# Altium schematic sheet Connectors.SchDoc: Main
size OrCAD A; DocumentNumber: LM-008; SheetNumber: 3; SheetTotal: 3; DocumentName: LM-008
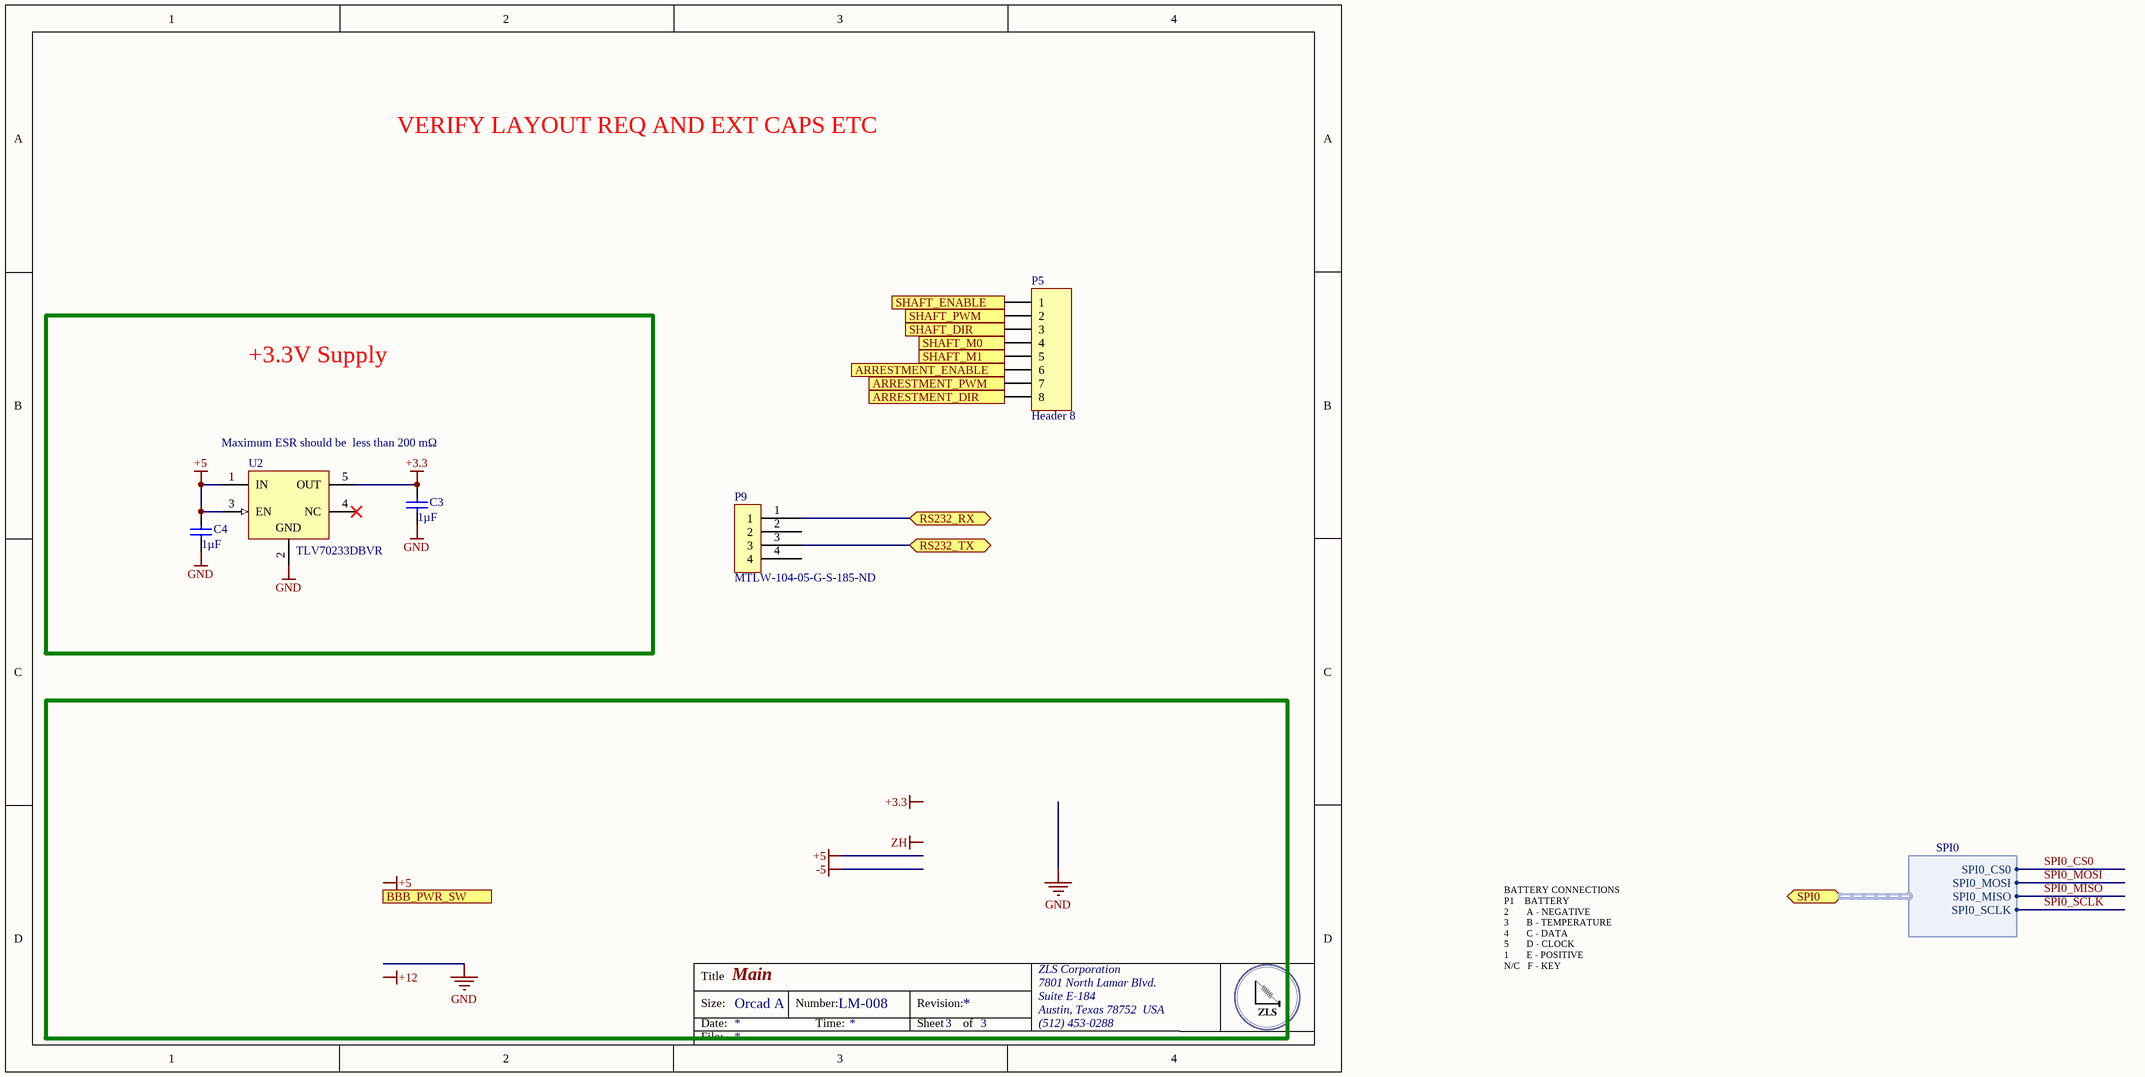
[diagram p0: Connectors.SchDoc]

## Parts
C3  Capacitance: 1µF  [CAPC1206(3216)130_N]  (hidden comment: CAP CER 1UF 50V X7R 1210)
C4  Capacitance: 1µF  [CAPC1206(3216)130_N]  (hidden comment: CAP CER 1UF 50V X7R 1210)
P5  Header 8  [HDR1X8]
P9  Supplier Part Number 1: MTLW-104-05-G-S-185-ND  [TLW-104-05-G-S]  (hidden comment: TLW-104-05-G-S)
U2  TLV70233DBVR  [DBV0005A_N]

## Blocks framed on the sheet
+3.3V Supply: C3 C4 U2

## Ports
ARRESTMENT_DIR, ARRESTMENT_ENABLE, ARRESTMENT_PWM, BBB_PWR_SW, RS232_RX, RS232_TX, SHAFT_DIR, SHAFT_ENABLE, SHAFT_M0, SHAFT_M1, SHAFT_PWM, SPI0 (harness SPI0)

## Harnesses
SPI0: SPI0_CS0, SPI0_MOSI, SPI0_MISO, SPI0_SCLK

## Nets
+3.3: C3.2 U2.5(OUT)
+5: C4.2 U2.1(IN) U2.3(EN)
GND: C3.1 C4.1 U2.2(GND)
ARRESTMENT_DIR: P5.8 ; port ARRESTMENT_DIR
ARRESTMENT_ENABLE: P5.6 ; port ARRESTMENT_ENABLE
ARRESTMENT_PWM: P5.7 ; port ARRESTMENT_PWM
RS232_RX: P9.1 ; port RS232_RX
RS232_TX: P9.3 ; port RS232_TX
SHAFT_DIR: P5.3 ; port SHAFT_DIR
SHAFT_ENABLE: P5.1 ; port SHAFT_ENABLE
SHAFT_M0: P5.4 ; port SHAFT_M0
SHAFT_M1: P5.5 ; port SHAFT_M1
SHAFT_PWM: P5.2 ; port SHAFT_PWM
SPI0_CS0: port SPI0.SPI0_CS0
SPI0_MISO: port SPI0.SPI0_MISO
SPI0_MOSI: port SPI0.SPI0_MOSI
SPI0_SCLK: port SPI0.SPI0_SCLK

Not connected (* = marked no-connect by the designer): P9 2 4; U2 4(NC)*

## Notes on the sheet
- VERIFY LAYOUT REQ AND EXT CAPS ETC
- Maximum ESR should be  less than 200 mΩ
- BATTERY CONNECTIONS
  P1    BATTERY
  2       A - NEGATIVE
  3       B - TEMPERATURE
  4       C - DATA
  5       D - CLOCK
  1       E - POSITIVE
  N/C   F - KEY
- Labels drawn without touching a wire or pin: +3.3, +5, +12, ZH
- Title
- Size:
- Date:
- Orcad A
- Number:
- Time:
- Revision:
- Sheet
- of
- ZLS Corporation
- 7801 North Lamar Blvd.
- Suite E-184
- Austin, Texas 78752  USA
- (512) 453-0288
- File:

## Library data of the parts
C3 C4 = CMP-1037-04913-1: Manufacturer: Murata Electronics North America; Manufacturer Part Number: GRM32RR71H105KA01L; Tolerance: ±10%; Supplier 1: Digi-Key; Supplier Part Number 1: 490-1863-6-ND; RoHS: RoHS Compliant; Category: Capacitors; Stock 1: 66890; Pricing 1: 1=0.35, 10=0.242, 100=0.1449, 500=0.10868 (USD); Packaging: Digi-Reel®; Part Status: Active; Voltage - Rated: 50V; Temperature Coefficient: X7R; Operating Temperature: -55°C ~ 125°C; Features: -; Ratings: -; Applications: General Purpose; Mounting Type: Surface Mount, MLCC; Package / Case: 1210 (3225 Metric); Size / Dimension: 0.126" L x 0.098" W (3.20mm x 2.50mm); Height - Seated (Max): -; Thickness (Max): 0.079" (2.00mm); Lead Spacing: -; Lead Style: -; ComponentLink1URL: http://search.murata.co.jp/Ceramy/image/img/A01X/G101/ENG/GRM32RR71H105KA01-01.pdf; ComponentLink1Description: http://search.murata.co.jp/Ceramy/image/img/A01X/G101/ENG/GRM32RR71H105KA01-01.pdf
P5 = Header 8: Header, 8-Pin; LatestRevisionDate: 17-Jul-2002; LatestRevisionNote: Re-released for DXP Platform.; Publisher: Altium Limited
U2 = CMP-0394-00528-2: Single Output LDO, 300 mA, Fixed 3.3 V Output, 2 to 5.5 V Input, with Low IQ, 5-pin SOT-23 (DBV), -40 to 125 degC, Green (RoHS & no Sb/Br); Manufacturer: Texas Instruments; Vout Adj(Max)(V): 3.3; Vin(Max)(V): 5.5; SubFamily: Single Channel LDO; Iq(Typ)(mA): 0.03; Iout(Max)(A): 0.3; Vin(Min)(V): 2; Vdo(Typ)(mV): 220; Vout Adj(Min)(V): 3.3; Eco-Plan: Green (RoHS & no Sb/Br); PackageVersion: 4073253-4/K; ComponentLink1Description: Manufacturer URL; DatasheetVersion: SLVSAG6B; ComponentLink2Description: Datasheet; ComponentLink3URL: http://www.ti.com/litv/pdf/mpds018i; ComponentLink2URL: http://www.ti.com/general/docs/lit/getliterature.tsp?genericPartNumber=TLV70233&fileType=pdf; PackageReference: DBV0005A; ComponentLink1URL: http://www.ti.com/; Mounting Technology: Surface Mount; ComponentLink3Description: Package Specification; PackageDescription: 5-Pin Plastic Small Outline, Body 1.60 Ãƒâ€” 2.90 mm, Pitch 0.95 mm; Code_JEDEC: MO-178; Fixed Output Options(V): 3.3; PartNumber: TLV70233DBVR; Accuracy(%): 2
P9 = TLW-104-05-G-S: Supplier 1: Digi-Key